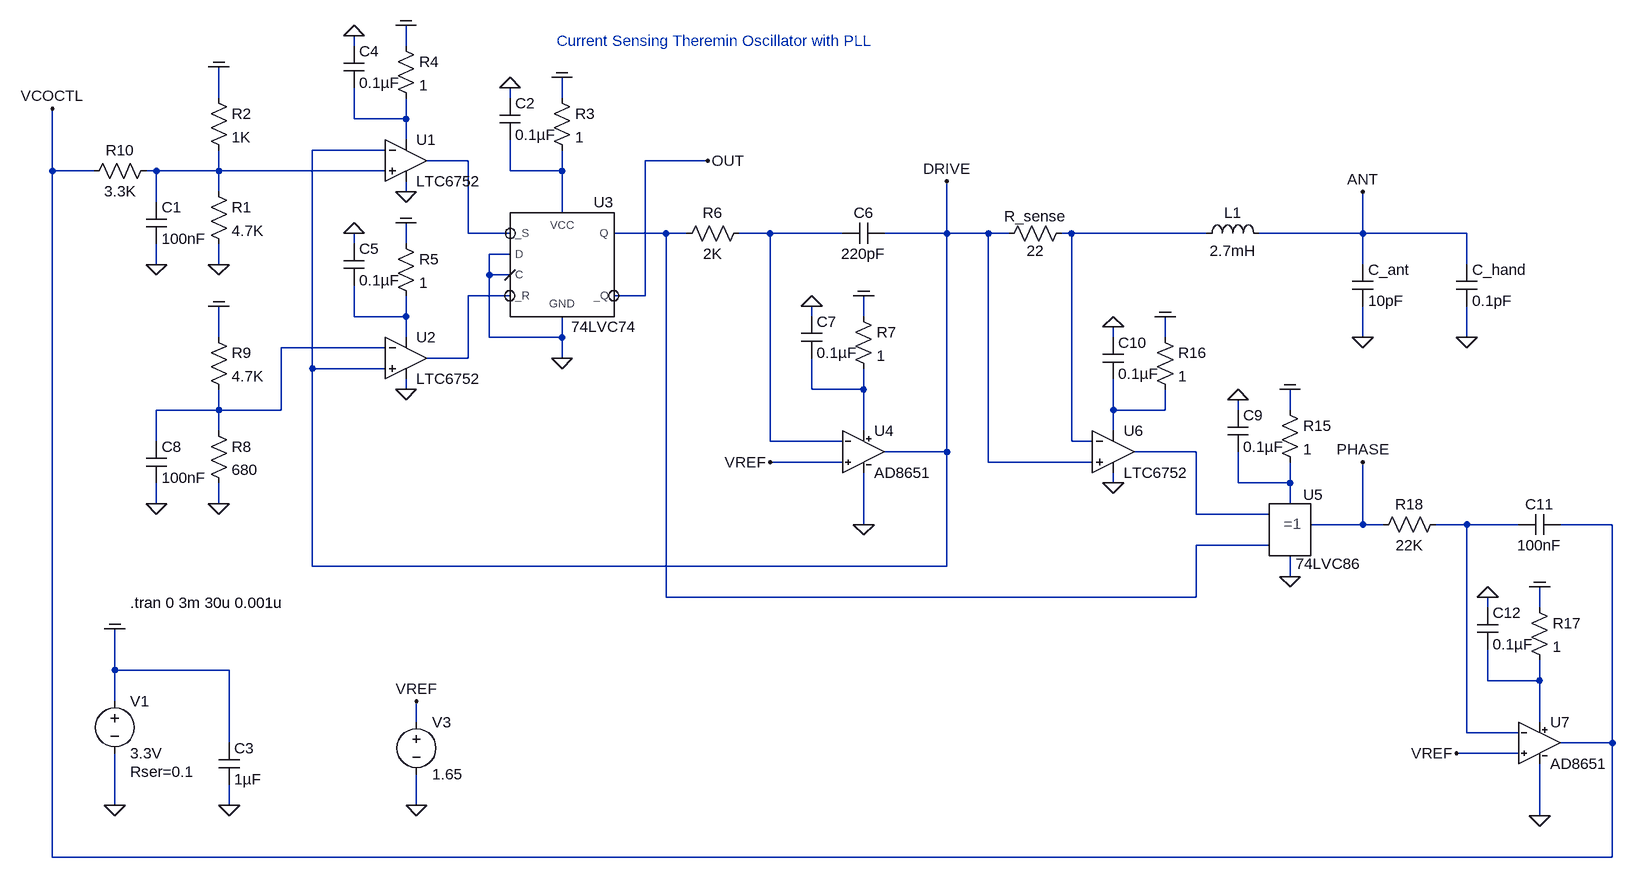
[diagram p0: schematic 2021_pll_current_sensing_04.asc]
2021_pll_current_sensing_04.asc, the LTspice schematic file:
Version 4
SHEET 1 2612 1348
WIRE 400 96 400 80
WIRE 480 96 480 64
WIRE 192 176 192 128
WIRE 640 176 640 160
WIRE 720 176 720 144
WIRE 400 208 400 160
WIRE 480 208 480 176
WIRE 480 208 400 208
WIRE 480 240 480 208
WIRE 448 256 336 256
WIRE 576 272 512 272
WIRE 944 272 848 272
WIRE -64 288 -64 192
WIRE 0 288 -64 288
WIRE 96 288 80 288
WIRE 192 288 192 256
WIRE 192 288 96 288
WIRE 448 288 192 288
WIRE 640 288 640 240
WIRE 720 288 720 256
WIRE 720 288 640 288
WIRE 192 320 192 288
WIRE 480 320 480 304
WIRE 96 336 96 288
WIRE 720 352 720 288
WIRE 576 384 576 272
WIRE 640 384 576 384
WIRE 880 384 800 384
WIRE 912 384 880 384
WIRE 1040 384 992 384
WIRE 1152 384 1040 384
WIRE 1312 384 1312 304
WIRE 1312 384 1216 384
WIRE 1376 384 1312 384
WIRE 1408 384 1376 384
WIRE 1504 384 1488 384
WIRE 1712 384 1504 384
WIRE 1952 384 1952 320
WIRE 1952 384 1792 384
WIRE 2112 384 1952 384
WIRE 400 400 400 384
WIRE 480 400 480 368
WIRE 640 416 608 416
WIRE 96 432 96 400
WIRE 192 432 192 400
WIRE 1952 432 1952 384
WIRE 2112 432 2112 384
WIRE 608 448 608 416
WIRE 640 448 608 448
WIRE 640 480 576 480
WIRE 848 480 848 272
WIRE 848 480 800 480
WIRE 400 512 400 464
WIRE 480 512 480 480
WIRE 480 512 400 512
WIRE 1104 512 1104 496
WIRE 1184 512 1184 480
WIRE 192 544 192 496
WIRE 480 544 480 512
WIRE 608 544 608 448
WIRE 720 544 720 512
WIRE 720 544 608 544
WIRE 1568 544 1568 528
WIRE 1648 544 1648 512
WIRE 1952 544 1952 496
WIRE 2112 544 2112 496
WIRE 448 560 288 560
WIRE 576 576 576 480
WIRE 576 576 512 576
WIRE 720 576 720 544
WIRE 336 592 336 256
WIRE 448 592 336 592
WIRE 480 624 480 608
WIRE 1104 624 1104 576
WIRE 1184 624 1184 592
WIRE 1184 624 1104 624
WIRE 192 656 192 624
WIRE 192 656 96 656
WIRE 288 656 288 560
WIRE 288 656 192 656
WIRE 1568 656 1568 608
WIRE 1648 656 1648 624
WIRE 1648 656 1568 656
WIRE 1760 656 1760 640
WIRE 1840 656 1840 624
WIRE 192 688 192 656
WIRE 1184 688 1184 624
WIRE 1568 688 1568 656
WIRE 96 704 96 656
WIRE 1040 704 1040 384
WIRE 1152 704 1040 704
WIRE 1504 704 1504 384
WIRE 1536 704 1504 704
WIRE 1312 720 1312 384
WIRE 1312 720 1216 720
WIRE 1696 720 1600 720
WIRE 1152 736 1040 736
WIRE 1376 736 1376 384
WIRE 1536 736 1376 736
WIRE 1568 768 1568 752
WIRE 1760 768 1760 720
WIRE 1840 768 1840 736
WIRE 1840 768 1760 768
WIRE 96 800 96 768
WIRE 192 800 192 768
WIRE 1840 800 1840 768
WIRE 1696 816 1696 720
WIRE 1808 816 1696 816
WIRE 1184 832 1184 752
WIRE 1952 832 1952 736
WIRE 1952 832 1872 832
WIRE 1984 832 1952 832
WIRE 2112 832 2064 832
WIRE 2192 832 2112 832
WIRE 2336 832 2256 832
WIRE 1808 864 1696 864
WIRE 336 896 336 592
WIRE 1312 896 1312 720
WIRE 1312 896 336 896
WIRE 1840 912 1840 880
WIRE 880 944 880 384
WIRE 1696 944 1696 864
WIRE 1696 944 880 944
WIRE 2144 960 2144 944
WIRE 2224 960 2224 928
WIRE 32 1056 32 992
WIRE 208 1056 32 1056
WIRE 2144 1072 2144 1024
WIRE 2224 1072 2224 1040
WIRE 2224 1072 2144 1072
WIRE 32 1104 32 1056
WIRE 496 1136 496 1104
WIRE 2224 1136 2224 1072
WIRE 2112 1152 2112 832
WIRE 2192 1152 2112 1152
WIRE 208 1168 208 1056
WIRE 2336 1168 2336 832
WIRE 2336 1168 2256 1168
WIRE 2192 1184 2096 1184
WIRE 32 1264 32 1184
WIRE 208 1264 208 1232
WIRE 496 1264 496 1216
WIRE 2224 1280 2224 1200
WIRE -64 1344 -64 288
WIRE 2336 1344 2336 1168
WIRE 2336 1344 -64 1344
FLAG 32 1264 0
FLAG 32 992 COM
FLAG 480 320 0
FLAG 480 624 0
FLAG 192 128 COM
FLAG 96 432 0
FLAG 192 432 0
FLAG 720 576 0
FLAG 720 144 COM
FLAG 640 160 0
FLAG 208 1264 0
FLAG 480 64 COM
FLAG 400 80 0
FLAG 480 368 COM
FLAG 400 384 0
FLAG 1184 832 0
FLAG 1184 480 COM
FLAG 1104 496 0
FLAG 1040 736 VREF
FLAG 496 1264 0
FLAG 496 1104 VREF
FLAG 192 496 COM
FLAG 96 800 0
FLAG 192 800 0
FLAG 1952 544 0
FLAG 1952 320 ANT
FLAG 1568 768 0
FLAG 1840 912 0
FLAG 1840 624 COM
FLAG 1760 640 0
FLAG 1648 512 COM
FLAG 1568 528 0
FLAG 2224 1280 0
FLAG 2224 928 COM
FLAG 2144 944 0
FLAG 2096 1184 VREF
FLAG 2112 544 0
FLAG 944 272 OUT
FLAG -64 192 VCOCTL
FLAG 1312 304 DRIVE
FLAG 1952 736 PHASE
SYMBOL voltage 32 1088 R0
WINDOW 123 0 0 Left 0
WINDOW 39 24 124 Left 2
SYMATTR SpiceLine Rser=0.1
SYMATTR InstName V1
SYMATTR Value 3.3V
SYMBOL res 176 304 R0
WINDOW 0 36 40 Left 2
WINDOW 3 36 76 Left 2
SYMATTR InstName R1
SYMATTR Value 4.7K
SYMBOL Comparators\\LTC6752 480 208 R0
SYMATTR InstName U1
SYMBOL Comparators\\LTC6752 480 512 R0
SYMATTR InstName U2
SYMBOL res 176 160 R0
WINDOW 0 36 40 Left 2
WINDOW 3 36 76 Left 2
SYMATTR InstName R2
SYMATTR Value 1K
SYMBOL cap 80 336 R0
SYMATTR InstName C1
SYMATTR Value 100nF
SYMBOL 74lvc74a 720 432 R0
SYMATTR InstName U3
SYMBOL res 704 160 R0
WINDOW 0 36 40 Left 2
WINDOW 3 36 76 Left 2
SYMATTR InstName R3
SYMATTR Value 1
SYMBOL cap 624 176 R0
SYMATTR InstName C2
SYMATTR Value 0.1µF
SYMBOL cap 192 1168 R0
SYMATTR InstName C3
SYMATTR Value 1µF
SYMBOL res 464 80 R0
WINDOW 0 36 40 Left 2
WINDOW 3 36 76 Left 2
SYMATTR InstName R4
SYMATTR Value 1
SYMBOL cap 384 96 R0
SYMATTR InstName C4
SYMATTR Value 0.1µF
SYMBOL res 464 384 R0
WINDOW 0 36 40 Left 2
WINDOW 3 36 76 Left 2
SYMATTR InstName R5
SYMATTR Value 1
SYMBOL cap 384 400 R0
SYMATTR InstName C5
SYMATTR Value 0.1µF
SYMBOL cap 1152 400 R270
WINDOW 0 32 32 VTop 2
WINDOW 3 0 32 VBottom 2
SYMATTR InstName C6
SYMATTR Value 220pF
SYMBOL res 1008 368 R90
WINDOW 0 0 56 VBottom 2
WINDOW 3 32 56 VTop 2
SYMATTR InstName R6
SYMATTR Value 2K
SYMBOL res 1168 496 R0
WINDOW 0 36 40 Left 2
WINDOW 3 36 76 Left 2
SYMATTR InstName R7
SYMATTR Value 1
SYMBOL cap 1088 512 R0
SYMATTR InstName C7
SYMATTR Value 0.1µF
SYMBOL voltage 496 1120 R0
WINDOW 123 0 0 Left 0
WINDOW 39 0 0 Left 0
SYMATTR InstName V3
SYMATTR Value 1.65
SYMBOL res 176 672 R0
WINDOW 0 36 40 Left 2
WINDOW 3 36 76 Left 2
SYMATTR InstName R8
SYMATTR Value 680
SYMBOL res 176 528 R0
WINDOW 0 36 40 Left 2
WINDOW 3 36 76 Left 2
SYMATTR InstName R9
SYMATTR Value 4.7K
SYMBOL cap 80 704 R0
SYMATTR InstName C8
SYMATTR Value 100nF
SYMBOL res 96 272 R90
WINDOW 0 0 56 VBottom 2
WINDOW 3 32 56 VTop 2
SYMATTR InstName R10
SYMATTR Value 3.3K
SYMBOL res 1504 368 R90
WINDOW 0 5 56 VBottom 2
WINDOW 3 27 56 VTop 2
SYMATTR InstName R_sense
SYMATTR Value 22
SYMBOL ind 1696 400 R270
WINDOW 0 32 56 VTop 2
WINDOW 3 5 56 VBottom 2
SYMATTR InstName L1
SYMATTR Value 2.7mH
SYMATTR SpiceLine Rser=120 Cpar=1.5pF
SYMBOL cap 1936 432 R0
SYMATTR InstName C_ant
SYMATTR Value 10pF
SYMBOL 74lvc86a 1856 832 R0
SYMATTR InstName U5
SYMBOL res 1824 640 R0
WINDOW 0 36 40 Left 2
WINDOW 3 36 76 Left 2
SYMATTR InstName R15
SYMATTR Value 1
SYMBOL cap 1744 656 R0
SYMATTR InstName C9
SYMATTR Value 0.1µF
SYMBOL res 1632 528 R0
WINDOW 0 36 40 Left 2
WINDOW 3 36 76 Left 2
SYMATTR InstName R16
SYMATTR Value 1
SYMBOL cap 1552 544 R0
SYMATTR InstName C10
SYMATTR Value 0.1µF
SYMBOL Comparators\\LTC6752 1568 656 R0
SYMATTR InstName U6
SYMBOL cap 2192 848 R270
WINDOW 0 32 32 VTop 2
WINDOW 3 0 32 VBottom 2
SYMATTR InstName C11
SYMATTR Value 100nF
SYMBOL res 2208 944 R0
WINDOW 0 36 40 Left 2
WINDOW 3 36 76 Left 2
SYMATTR InstName R17
SYMATTR Value 1
SYMBOL cap 2128 960 R0
SYMATTR InstName C12
SYMATTR Value 0.1µF
SYMBOL ad8651 2224 1104 R0
SYMATTR InstName U7
SYMBOL res 2080 816 R90
WINDOW 0 0 56 VBottom 2
WINDOW 3 32 56 VTop 2
SYMATTR InstName R18
SYMATTR Value 22K
SYMBOL cap 2096 432 R0
SYMATTR InstName C_hand
SYMATTR Value 0.1pF
SYMBOL ad8651 1184 656 R0
SYMATTR InstName U4
TEXT 712 88 Left 2 ;Current Sensing Theremin Oscillator with PLL
TEXT 56 952 Left 2 !.tran 0 3m 30u 0.001u

The netlist it stands for:
* 2021_pll_current_sensing_04.asc
V1 COM 0 3.3V Rser=0.1
R1 N003 0 4.7K
XU1 N003 DRIVE N001 0 N002 LTC6752  ; pins In+ In- V+ V- OUT
XU2 DRIVE N010 N009 0 N008 LTC6752  ; pins In+ In- V+ V- OUT
R2 COM N003 1K
C1 N003 0 100nF
XU3 N008 0 0 N002 N005 OUT 0 N004 74LVC74  ; pins _R D C _S Q _Q GND VCC
R3 COM N004 1
C2 0 N004 0.1µF
C3 COM 0 1µF
R4 COM N001 1
C4 0 N001 0.1µF
R5 COM N009 1
C5 0 N009 0.1µF
C6 N006 DRIVE 220pF
R6 N006 N005 2K
R7 COM N011 1
C7 0 N011 0.1µF
V3 VREF 0 1.65
R8 N010 0 680
R9 COM N010 4.7K
C8 N010 0 100nF
R10 N003 VCOCTL 3.3K
R_sense N007 DRIVE 22
L1 N007 ANT 2.7mH Rser=120 Cpar=1.5pF
C_ant ANT 0 10pF
XU5 PHASE N005 N013 N014 0 74LVC86  ; pins Y A B VCC AGND
R15 COM N014 1
C9 0 N014 0.1µF
R16 COM N012 1
C10 0 N012 0.1µF
XU6 DRIVE N007 N012 0 N013 LTC6752  ; pins In+ In- V+ V- OUT
C11 N015 VCOCTL 100nF
R17 COM N016 1
C12 0 N016 0.1µF
XU7 VREF N015 N016 0 VCOCTL AD8651  ; pins In+ In- V+ V- OUT
R18 N015 PHASE 22K
C_hand ANT 0 0.1pF
XU4 VREF N006 N011 0 DRIVE AD8651  ; pins In+ In- V+ V- OUT
* Current Sensing Theremin Oscillator with PLL
.tran 0 3m 30u 0.001u
.lib LTC7.lib
.lib 74lvc74a.cir
.lib 74lvc86a.cir
.lib ad8651.cir
.backanno
.end